# Altium schematic sheet 407-485.schdoc
size A4
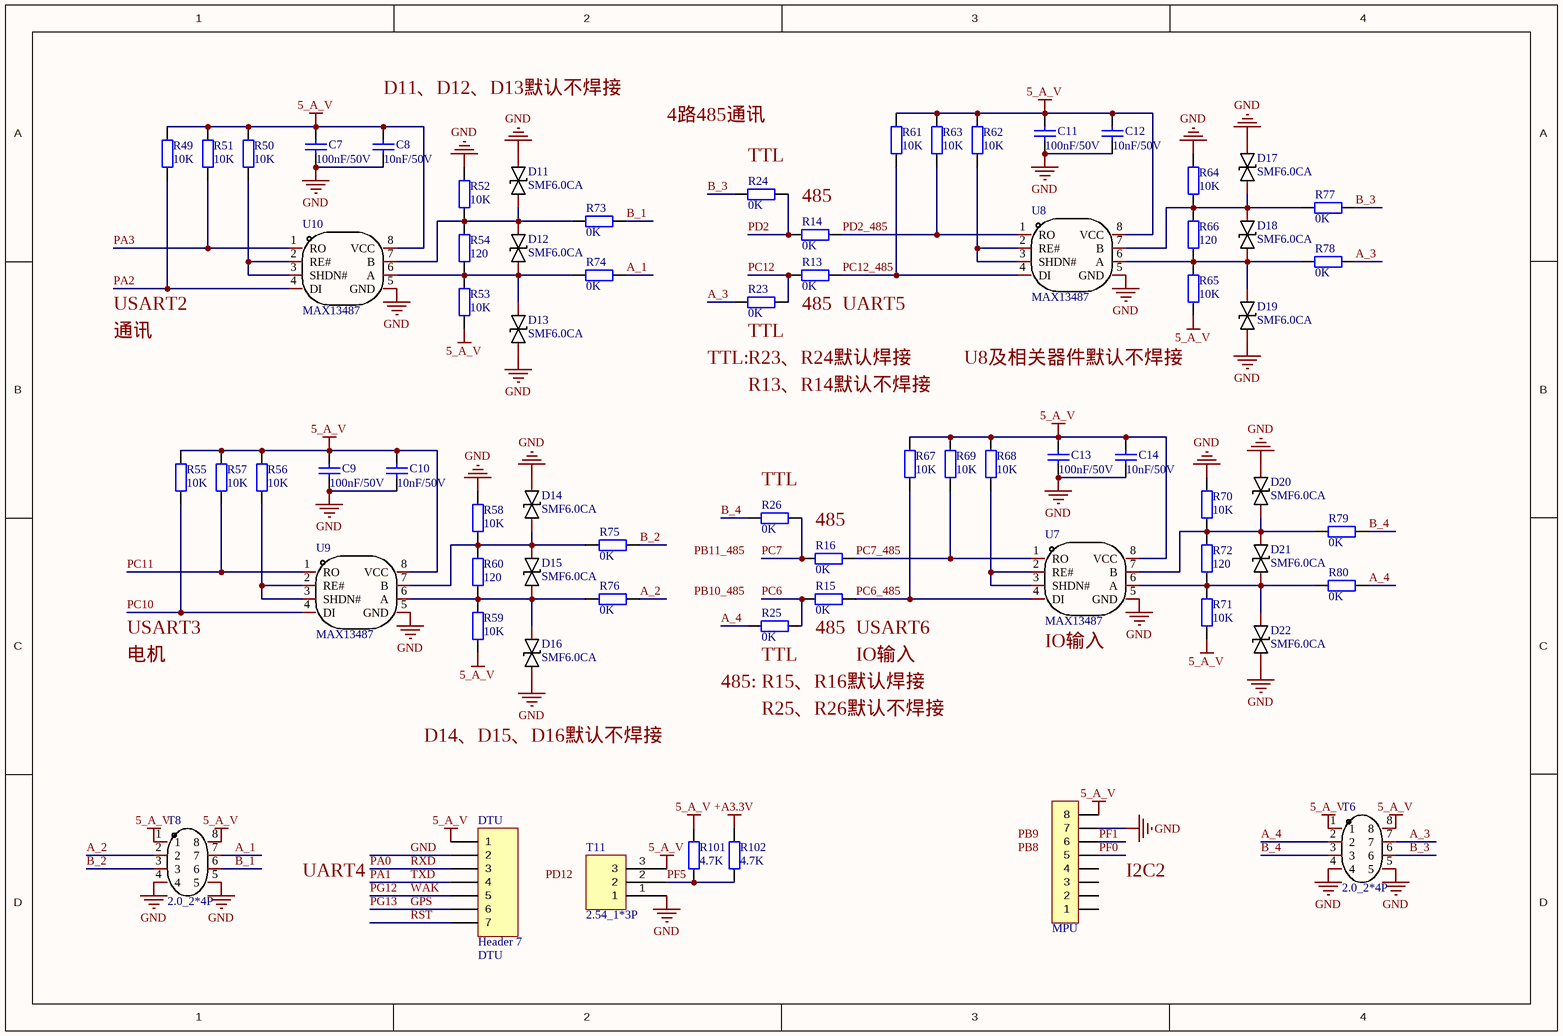
[diagram p0: 407-485.schdoc]

## Parts
C7  100nF/50V
C8  10nF/50V
C9  100nF/50V
C10  10nF/50V
C11  100nF/50V
C12  10nF/50V
C13  100nF/50V
C14  10nF/50V
D11  SMF6.0CA  [SMF6.0CA]
D12  SMF6.0CA  [SMF6.0CA]
D13  SMF6.0CA  [SMF6.0CA]
D14  SMF6.0CA  [SMF6.0CA]
D15  SMF6.0CA  [SMF6.0CA]
D16  SMF6.0CA  [SMF6.0CA]
D17  SMF6.0CA  [SMF6.0CA]
D18  SMF6.0CA  [SMF6.0CA]
D19  SMF6.0CA  [SMF6.0CA]
D20  SMF6.0CA  [SMF6.0CA]
D21  SMF6.0CA  [SMF6.0CA]
D22  SMF6.0CA  [SMF6.0CA]
DTU  Header 7  [HDR1X7]
MPU  HDR-1X8  [HDR2.54-M-LI-8P]  (value not drawn)
R13  0K  [R0603_L]
R14  0K  [R0603_L]
R15  0K  [R0603_L]
R16  0K  [R0603_L]
R23  0K  [R0603_L]
R24  0K  [R0603_L]
R25  0K  [R0603_L]
R26  0K  [R0603_L]
R49  10K  [R0603_L]
R50  10K  [R0603_L]
R51  10K  [R0603_L]
R52  10K  [R0603_L]
R53  10K  [R0603_L]
R54  120  [R0603_L]
R55  10K  [R0603_L]
R56  10K  [R0603_L]
R57  10K  [R0603_L]
R58  10K  [R0603_L]
R59  10K  [R0603_L]
R60  120  [R0603_L]
R61  10K  [R0603_L]
R62  10K  [R0603_L]
R63  10K  [R0603_L]
R64  10K  [R0603_L]
R65  10K  [R0603_L]
R66  120  [R0603_L]
R67  10K  [R0603_L]
R68  10K  [R0603_L]
R69  10K  [R0603_L]
R70  10K  [R0603_L]
R71  10K  [R0603_L]
R72  120  [R0603_L]
R73  0K  [R0603_L]
R74  0K  [R0603_L]
R75  0K  [R0603_L]
R76  0K  [R0603_L]
R77  0K  [R0603_L]
R78  0K  [R0603_L]
R79  0K  [R0603_L]
R80  0K  [R0603_L]
R101  4.7K
R102  4.7K
T6  2.0_2*4P  [2.0_2*4P]
T8  2.0_2*4P  [2.0_2*4P]
T11  2.54_1*3P  [2.54_1*3P]
U7  MAX13487  [MAX13487]
U8  MAX13487  [MAX13487]
U9  MAX13487  [MAX13487]
U10  MAX13487  [MAX13487]

## Nets
5_A_V: C7.1 C8.1 C9.1 C10.1 C11.1 C12.1 C13.1 C14.1 DTU.1 MPU.8 R49.2 R50.2 R51.2 R53.1 R55.2 R56.2 R57.2 R59.1 R61.2 R62.2 R63.2 R65.1 R67.2 R68.2 R69.2 R71.1 R101.2 T6.1 T6.8 T8.1 T8.8 T11.3 U7.8(VCC) U8.8(VCC) U9.8(VCC) U10.8(VCC)
+A3.3V: R102.2
GND: C7.2 C8.2 C9.2 C10.2 C11.2 C12.2 C13.2 C14.2 D11.2 D13.1 D14.2 D16.1 D17.2 D19.1 D20.2 D22.1 DTU.2 MPU.7 R52.2 R58.2 R64.2 R70.2 T6.4 T6.5 T8.4 T8.5 T11.1 U7.5(GND) U8.5(GND) U9.5(GND) U10.5(GND)
A_1: R74.1 T8.7
A_2: R76.1 T8.2
A_3: R23.2 R78.1 T6.7
A_4: R25.2 R80.1 T6.2
B_1: R73.1 T8.6
B_2: R75.1 T8.3
B_3: R24.2 R77.1 T6.6
B_4: R26.1 R79.1 T6.3
GPS: DTU.6  [also labelled PG13]
PA0: DTU.3  [also labelled RXD]
PA1: DTU.4  [also labelled TXD]
PA2: R49.1 U10.4(DI)
PA3: R51.1 U10.1(RO)
PC6: R15.2 R25.1
PC6_485: R15.1 R67.1 U7.4(DI)
PC7: R16.2 R26.2
PC7_485: R16.1 R69.1 U7.1(RO)
PC10: R55.1 U9.4(DI)
PC11: R57.1 U9.1(RO)
PC12: R13.2 R23.1
PC12_485: R13.1 R61.1 U8.4(DI)
PD2: R14.2 R24.1
PD2_485: R14.1 R63.1 U8.1(RO)
PF0: MPU.5
PF1: MPU.6
PF5: R101.1 R102.1 T11.2
PG12: DTU.5  [also labelled WAK]
RST: DTU.7
NetD11_1: D11.1 D12.2 R52.1 R54.2 R73.2 U10.7(B)
NetD12_1: D12.1 D13.2 R53.2 R54.1 R74.2 U10.6(A)
NetD14_1: D14.1 D15.2 R58.1 R60.2 R75.2 U9.7(B)
NetD15_1: D15.1 D16.2 R59.2 R60.1 R76.2 U9.6(A)
NetD17_1: D17.1 D18.2 R64.1 R66.2 R77.2 U8.7(B)
NetD18_1: D18.1 D19.2 R65.2 R66.1 R78.2 U8.6(A)
NetD20_1: D20.1 D21.2 R70.1 R72.2 R79.2 U7.7(B)
NetD21_1: D21.1 D22.2 R71.2 R72.1 R80.2 U7.6(A)
NetR50_1: R50.1 U10.2(RE#) U10.3(SHDN#)
NetR56_1: R56.1 U9.2(RE#) U9.3(SHDN#)
NetR62_1: R62.1 U8.2(RE#) U8.3(SHDN#)
NetR68_1: R68.1 U7.2(RE#) U7.3(SHDN#)

Not connected (* = marked no-connect by the designer): MPU 1 2 3 4

## Notes on the sheet
- (near C8) D11、D12、D13默认不焊接
- 4路485通讯
- (near R24) TTL
- 485
- USART2
- (near R13) UART5
- 通讯
- (near R23) TTL:
- (near R23) TTL
- R23、R24默认焊接
- U8及相关器件默认不焊接
- R13、R14默认不焊接
- (near R26) TTL
- USART3
- (near R15) USART6
- (near U7) IO输入
- 电机
- (near R25) 485:
- R15、R16默认焊接
- R25、R26默认不焊接
- (near R25) TTL
- IO输入
- D14、D15、D16默认不焊接
- UART4
- (near MPU) I2C2
- (near DTU) DTU
- Labels drawn without touching a wire or pin: PB8, PB9, PB10_485, PB11_485, PD12

## Library data of the parts
C7-C14 = Cap: Capacitor; Published: 8-Jun-2000; LatestRevisionDate: 17-Jul-2002; LatestRevisionNote: Re-released for DXP Platform.; PackageReference: RAD-0.3; Publisher: Altium Limited; PackageDescription: Radial Cap, Thru-Hole; 2 Leads; 0.3 in Pin Spacing
  C7 C9 C11 C13: Value: 100nF/50V
  C8 C10 C12 C14: Value: 10nF/50V
DTU = Header 7: Header, 7-Pin; LatestRevisionDate: 17-Jul-2002; LatestRevisionNote: Re-released for DXP Platform.; Publisher: Altium Limited
MPU = Header 8: 8P接插件; 版权归属: 封装库来自淘宝 ID：黄晶宝石; BOM名称: 8P接插件; 学习资源: https://shop463601444.taobao.com
R13-R16 R23-R26 R73-R80 R101 R102 = Res2: Resistor; Published: 8-Jun-2000; LatestRevisionDate: 17-Jul-2002; LatestRevisionNote: Re-released for DXP Platform.; PackageReference: AXIAL-0.4; Publisher: Altium Limited; PackageDescription: Axial Device, Thru-Hole; 2 Leads; 0.4 in Pin Spacing
  R13-R16 R23-R26 R73-R80: Value: 0K
  R101 R102: Value: 4.7K
R49-R72 = Res2: Resistor; Value: 0K; Published: 8-Jun-2000; LatestRevisionDate: 17-Jul-2002; LatestRevisionNote: Re-released for DXP Platform.; PackageReference: AXIAL-0.4; Publisher: Altium Limited; PackageDescription: Axial Device, Thru-Hole; 2 Leads; 0.4 in Pin Spacing